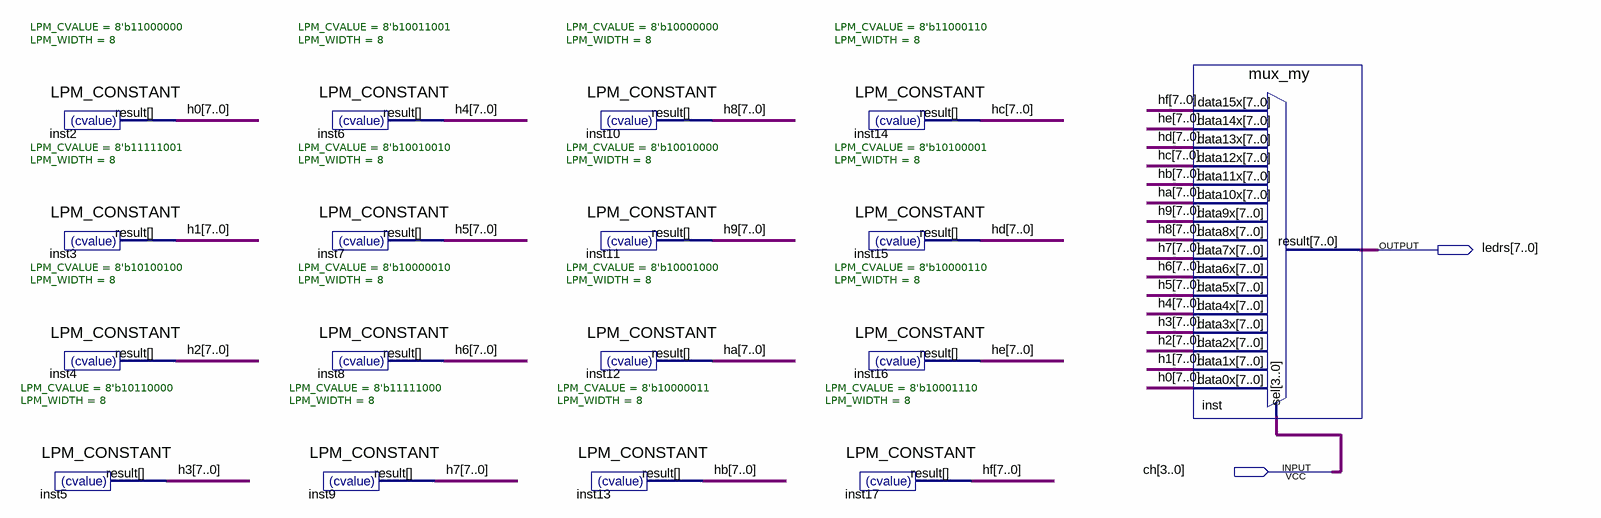
[diagram p0: schematic sheet]
// Quartus schematic Block1.bdf as structural Verilog: 17 symbols, 2 pins
module Block1 (
  input  [3:0] ch,
  output [7:0] ledrs
);

  wire [7:0] h0, h1, h2, h3, h4, h5, h6, h7, h8, h9, ha, hb, hc, hd, he, hf;

  LPM_CONSTANT #(.LPM_CVALUE(8'b11000000), .LPM_WIDTH(8)) inst2 (.result(h0));
  LPM_CONSTANT #(.LPM_CVALUE(8'b11111001), .LPM_WIDTH(8)) inst3 (.result(h1));
  LPM_CONSTANT #(.LPM_CVALUE(8'b10100100), .LPM_WIDTH(8)) inst4 (.result(h2));
  LPM_CONSTANT #(.LPM_CVALUE(8'b10110000), .LPM_WIDTH(8)) inst5 (.result(h3));
  LPM_CONSTANT #(.LPM_CVALUE(8'b10011001), .LPM_WIDTH(8)) inst6 (.result(h4));
  LPM_CONSTANT #(.LPM_CVALUE(8'b10010010), .LPM_WIDTH(8)) inst7 (.result(h5));
  LPM_CONSTANT #(.LPM_CVALUE(8'b10000010), .LPM_WIDTH(8)) inst8 (.result(h6));
  LPM_CONSTANT #(.LPM_CVALUE(8'b11111000), .LPM_WIDTH(8)) inst9 (.result(h7));
  LPM_CONSTANT #(.LPM_CVALUE(8'b10000000), .LPM_WIDTH(8)) inst10 (.result(h8));
  LPM_CONSTANT #(.LPM_CVALUE(8'b10010000), .LPM_WIDTH(8)) inst11 (.result(h9));
  LPM_CONSTANT #(.LPM_CVALUE(8'b10001000), .LPM_WIDTH(8)) inst12 (.result(ha));
  LPM_CONSTANT #(.LPM_CVALUE(8'b10000011), .LPM_WIDTH(8)) inst13 (.result(hb));
  LPM_CONSTANT #(.LPM_CVALUE(8'b11000110), .LPM_WIDTH(8)) inst14 (.result(hc));
  LPM_CONSTANT #(.LPM_CVALUE(8'b10100001), .LPM_WIDTH(8)) inst15 (.result(hd));
  LPM_CONSTANT #(.LPM_CVALUE(8'b10000110), .LPM_WIDTH(8)) inst16 (.result(he));
  LPM_CONSTANT #(.LPM_CVALUE(8'b10001110), .LPM_WIDTH(8)) inst17 (.result(hf));
  mux_my inst (
    .data15x(hf), .data14x(he), .data13x(hd), .data12x(hc), .data11x(hb), .data10x(ha), .data9x(h9),
    .data8x(h8), .data7x(h7), .data6x(h6), .data5x(h5), .data4x(h4), .data3x(h3), .data2x(h2), .data1x(h1),
    .data0x(h0), .sel(ch), .result(ledrs));
endmodule
